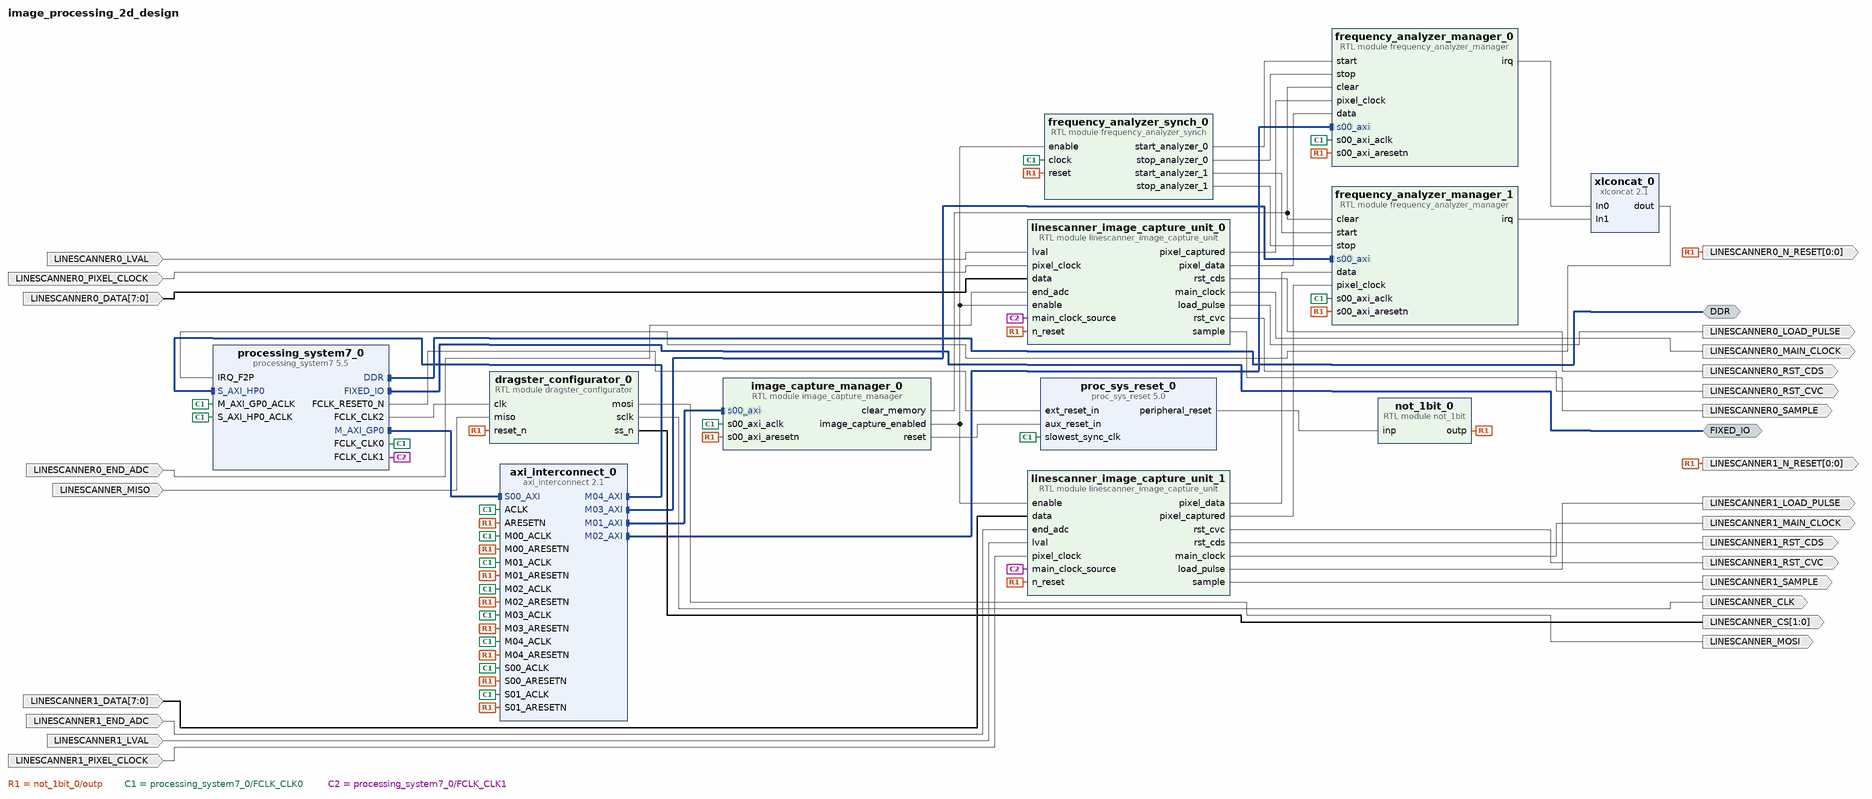
[diagram p0: block diagram of the top level]
# Vivado block design image_processing_2d_design, Vivado 2016.2
create_bd_design image_processing_2d_design

create_bd_intf_port -mode Master -vlnv xilinx.com:interface:ddrx_rtl:1.0 DDR
create_bd_intf_port -mode Master -vlnv xilinx.com:display_processing_system7:fixedio_rtl:1.0 FIXED_IO
create_bd_port -dir O -from 0 -to 0 -type rst LINESCANNER0_N_RESET
create_bd_port -dir O -from 0 -to 0 -type rst LINESCANNER1_N_RESET
create_bd_port -dir I LINESCANNER0_LVAL
create_bd_port -dir I -type clk LINESCANNER0_PIXEL_CLOCK
set_property -dict {CONFIG.FREQ_HZ 25000000} [get_bd_ports LINESCANNER0_PIXEL_CLOCK]
create_bd_port -dir O LINESCANNER0_RST_CVC
create_bd_port -dir O LINESCANNER0_RST_CDS
create_bd_port -dir O LINESCANNER0_SAMPLE
create_bd_port -dir O -type clk LINESCANNER0_MAIN_CLOCK
create_bd_port -dir O LINESCANNER0_LOAD_PULSE
create_bd_port -dir I -from 7 -to 0 LINESCANNER0_DATA
create_bd_port -dir I LINESCANNER0_END_ADC
create_bd_port -dir I -from 7 -to 0 LINESCANNER1_DATA
create_bd_port -dir I LINESCANNER1_END_ADC
create_bd_port -dir I LINESCANNER1_LVAL
create_bd_port -dir I -type clk LINESCANNER1_PIXEL_CLOCK
set_property -dict {CONFIG.FREQ_HZ 25000000} [get_bd_ports LINESCANNER1_PIXEL_CLOCK]
create_bd_port -dir O LINESCANNER1_RST_CVC
create_bd_port -dir O LINESCANNER1_RST_CDS
create_bd_port -dir O LINESCANNER1_SAMPLE
create_bd_port -dir O -type clk LINESCANNER1_MAIN_CLOCK
create_bd_port -dir O LINESCANNER1_LOAD_PULSE
create_bd_port -dir O LINESCANNER_MOSI
create_bd_port -dir I LINESCANNER_MISO
create_bd_port -dir O -type clk LINESCANNER_CLK
create_bd_port -dir O -from 1 -to 0 LINESCANNER_CS

create_bd_cell -type ip -vlnv xilinx.com:ip:processing_system7:5.5 processing_system7_0
set_property -dict [list \
  CONFIG.PCW_FCLK_CLK0_BUF true \
  CONFIG.PCW_FCLK_CLK1_BUF true \
  CONFIG.PCW_FCLK_CLK2_BUF true \
  CONFIG.PCW_UIPARAM_DDR_FREQ_MHZ 533.333313 \
  CONFIG.PCW_CPU_CPU_6X4X_MAX_RANGE 867 \
  CONFIG.PCW_APU_PERIPHERAL_FREQMHZ 666.666667 \
  CONFIG.PCW_SDIO_PERIPHERAL_FREQMHZ 50 \
  CONFIG.PCW_UART_PERIPHERAL_FREQMHZ 50 \
  CONFIG.PCW_FPGA0_PERIPHERAL_FREQMHZ 100 \
  CONFIG.PCW_FPGA1_PERIPHERAL_FREQMHZ 50 \
  CONFIG.PCW_FPGA2_PERIPHERAL_FREQMHZ 20 \
  CONFIG.PCW_USE_S_AXI_HP0 1 \
  CONFIG.PCW_M_AXI_GP0_FREQMHZ 50 \
  CONFIG.PCW_S_AXI_HP0_FREQMHZ 142 \
  CONFIG.PCW_USE_CROSS_TRIGGER 1 \
  CONFIG.PCW_FTM_CTI_IN0 DISABLED \
  CONFIG.PCW_FTM_CTI_IN1 DISABLED \
  CONFIG.PCW_FTM_CTI_IN2 DISABLED \
  CONFIG.PCW_FTM_CTI_IN3 DISABLED \
  CONFIG.PCW_FTM_CTI_OUT0 DISABLED \
  CONFIG.PCW_FTM_CTI_OUT1 DISABLED \
  CONFIG.PCW_FTM_CTI_OUT2 DISABLED \
  CONFIG.PCW_FTM_CTI_OUT3 DISABLED \
  CONFIG.PCW_USE_FABRIC_INTERRUPT 1 \
  CONFIG.PCW_GPIO_EMIO_GPIO_WIDTH 4 \
  CONFIG.PCW_S_AXI_HP0_DATA_WIDTH 32 \
  CONFIG.PCW_EN_CLK1_PORT 1 \
  CONFIG.PCW_EN_CLK2_PORT 1 \
  CONFIG.PCW_EN_RST1_PORT 1 \
  CONFIG.PCW_IRQ_F2P_INTR 1 \
  CONFIG.PCW_PERIPHERAL_BOARD_PRESET part0 \
  CONFIG.PCW_PRESET_BANK1_VOLTAGE {LVCMOS 3.3V} \
  CONFIG.PCW_UIPARAM_DDR_BUS_WIDTH {16 Bit} \
  CONFIG.PCW_UIPARAM_DDR_PARTNO Custom \
  CONFIG.PCW_NAND_PERIPHERAL_ENABLE 1 \
  CONFIG.PCW_NAND_NAND_IO {MIO 0 2.. 14} \
  CONFIG.PCW_ENET0_PERIPHERAL_ENABLE 0 \
  CONFIG.PCW_SD0_PERIPHERAL_ENABLE 1 \
  CONFIG.PCW_SD0_SD0_IO {MIO 28 .. 33} \
  CONFIG.PCW_SD0_GRP_CD_ENABLE 1 \
  CONFIG.PCW_SD0_GRP_CD_IO {MIO 35} \
  CONFIG.PCW_SD0_GRP_WP_ENABLE 1 \
  CONFIG.PCW_SD0_GRP_WP_IO {MIO 34} \
  CONFIG.PCW_UART1_PERIPHERAL_ENABLE 1 \
  CONFIG.PCW_UART1_UART1_IO {MIO 48 .. 49} \
  CONFIG.PCW_TTC0_PERIPHERAL_ENABLE 1 \
  CONFIG.PCW_TTC0_TTC0_IO EMIO \
  CONFIG.PCW_USB0_PERIPHERAL_ENABLE 0 \
  CONFIG.PCW_USB_RESET_ENABLE 0 \
  CONFIG.PCW_I2C_RESET_ENABLE 0 \
  CONFIG.PCW_GPIO_MIO_GPIO_ENABLE 1 \
  CONFIG.PCW_GPIO_MIO_GPIO_IO MIO \
  CONFIG.PCW_GPIO_EMIO_GPIO_ENABLE 1 \
  CONFIG.PCW_GPIO_EMIO_GPIO_IO 4 \
  CONFIG.PCW_ENET1_PERIPHERAL_CLKSRC External \
  CONFIG.PCW_UIPARAM_GENERATE_SUMMARY NONE \
  CONFIG.PCW_FPGA_FCLK1_ENABLE 1 \
  CONFIG.PCW_FPGA_FCLK2_ENABLE 1 \
] [get_bd_cells processing_system7_0]
# 504 more settings of processing_system7_0 are not shown: defaults, MIO pin electricals, DDR timing, and values the tool derives
create_bd_cell -type ip -vlnv xilinx.com:ip:proc_sys_reset:5.0 proc_sys_reset_0
set_property -dict {CONFIG.C_AUX_RST_WIDTH 16 CONFIG.C_EXT_RST_WIDTH 16} [get_bd_cells proc_sys_reset_0]
create_bd_cell -type ip -vlnv xilinx.com:ip:axi_interconnect:2.1 axi_interconnect_0
set_property -dict {CONFIG.NUM_SI 2 CONFIG.NUM_MI 5} [get_bd_cells axi_interconnect_0]
create_bd_cell -type ip -vlnv xilinx.com:ip:xlconcat:2.1 xlconcat_0
set_property -dict {CONFIG.IN0_WIDTH 1 CONFIG.IN1_WIDTH 1} [get_bd_cells xlconcat_0]
create_bd_cell -type module -reference frequency_analyzer_synch frequency_analyzer_synch_0
create_bd_cell -type module -reference linescanner_image_capture_unit linescanner_image_capture_unit_0
create_bd_cell -type module -reference not_1bit not_1bit_0
create_bd_cell -type module -reference image_capture_manager image_capture_manager_0
create_bd_cell -type module -reference linescanner_image_capture_unit linescanner_image_capture_unit_1
create_bd_cell -type module -reference frequency_analyzer_manager frequency_analyzer_manager_0
set_property -dict [list \
  CONFIG.PIXEL0_INDEX 63 \
  CONFIG.PIXEL1_INDEX 511 \
  CONFIG.PIXEL2_INDEX 1000 \
  CONFIG.PIXEL0_FREQUENCY0 5000 \
  CONFIG.PIXEL0_FREQUENCY1 10000 \
  CONFIG.PIXEL2_FREQUENCY0 40000 \
  CONFIG.PIXEL2_FREQUENCY1 50000 \
  CONFIG.FREQUENCY_DEVIATION 20 \
] [get_bd_cells frequency_analyzer_manager_0]
create_bd_cell -type module -reference frequency_analyzer_manager frequency_analyzer_manager_1
set_property -dict [list \
  CONFIG.PIXEL0_INDEX 63 \
  CONFIG.PIXEL2_INDEX 1000 \
  CONFIG.PIXEL0_FREQUENCY0 5000 \
  CONFIG.PIXEL0_FREQUENCY1 10000 \
  CONFIG.PIXEL2_FREQUENCY0 40000 \
  CONFIG.PIXEL2_FREQUENCY1 50000 \
  CONFIG.FREQUENCY_DEVIATION 20 \
] [get_bd_cells frequency_analyzer_manager_1]
create_bd_cell -type module -reference dragster_configurator dragster_configurator_0

# ---- connections ----

connect_bd_intf_net [get_bd_intf_pins processing_system7_0/M_AXI_GP0] [get_bd_intf_pins axi_interconnect_0/S00_AXI]
connect_bd_intf_net [get_bd_intf_pins image_capture_manager_0/s00_axi] [get_bd_intf_pins axi_interconnect_0/M01_AXI]
connect_bd_intf_net [get_bd_intf_pins frequency_analyzer_manager_0/s00_axi] [get_bd_intf_pins axi_interconnect_0/M02_AXI]
connect_bd_intf_net [get_bd_intf_pins axi_interconnect_0/M03_AXI] [get_bd_intf_pins frequency_analyzer_manager_1/s00_axi]
connect_bd_intf_net [get_bd_intf_pins axi_interconnect_0/M04_AXI] [get_bd_intf_pins processing_system7_0/S_AXI_HP0]
connect_bd_intf_net [get_bd_intf_ports DDR] [get_bd_intf_pins processing_system7_0/DDR]
connect_bd_intf_net [get_bd_intf_ports FIXED_IO] [get_bd_intf_pins processing_system7_0/FIXED_IO]
connect_bd_net [get_bd_pins processing_system7_0/FCLK_RESET0_N] [get_bd_pins proc_sys_reset_0/ext_reset_in]
connect_bd_net -net proc_sys_reset_0_peripheral_aresetn [get_bd_pins not_1bit_0/outp] \
  [get_bd_ports LINESCANNER1_N_RESET] [get_bd_ports LINESCANNER0_N_RESET] [get_bd_pins frequency_analyzer_synch_0/reset] \
  [get_bd_pins linescanner_image_capture_unit_0/n_reset] [get_bd_pins image_capture_manager_0/s00_axi_aresetn] \
  [get_bd_pins axi_interconnect_0/ARESETN] [get_bd_pins axi_interconnect_0/S00_ARESETN] \
  [get_bd_pins axi_interconnect_0/M00_ARESETN] [get_bd_pins axi_interconnect_0/M01_ARESETN] \
  [get_bd_pins axi_interconnect_0/S01_ARESETN] [get_bd_pins axi_interconnect_0/M02_ARESETN] \
  [get_bd_pins axi_interconnect_0/M03_ARESETN] [get_bd_pins axi_interconnect_0/M04_ARESETN] \
  [get_bd_pins linescanner_image_capture_unit_1/n_reset] [get_bd_pins frequency_analyzer_manager_0/s00_axi_aresetn] \
  [get_bd_pins frequency_analyzer_manager_1/s00_axi_aresetn] [get_bd_pins dragster_configurator_0/reset_n]
connect_bd_net [get_bd_pins image_capture_manager_0/image_capture_enabled] \
  [get_bd_pins frequency_analyzer_synch_0/enable] [get_bd_pins linescanner_image_capture_unit_0/enable] \
  [get_bd_pins linescanner_image_capture_unit_1/enable]
connect_bd_net [get_bd_pins processing_system7_0/FCLK_CLK0] \
  [get_bd_pins proc_sys_reset_0/slowest_sync_clk] [get_bd_pins processing_system7_0/M_AXI_GP0_ACLK] \
  [get_bd_pins processing_system7_0/S_AXI_HP0_ACLK] [get_bd_pins frequency_analyzer_synch_0/clock] \
  [get_bd_pins image_capture_manager_0/s00_axi_aclk] [get_bd_pins axi_interconnect_0/ACLK] \
  [get_bd_pins axi_interconnect_0/S00_ACLK] [get_bd_pins axi_interconnect_0/M00_ACLK] \
  [get_bd_pins axi_interconnect_0/M01_ACLK] [get_bd_pins axi_interconnect_0/S01_ACLK] \
  [get_bd_pins axi_interconnect_0/M02_ACLK] [get_bd_pins axi_interconnect_0/M03_ACLK] \
  [get_bd_pins axi_interconnect_0/M04_ACLK] [get_bd_pins frequency_analyzer_manager_0/s00_axi_aclk] \
  [get_bd_pins frequency_analyzer_manager_1/s00_axi_aclk]
connect_bd_net [get_bd_pins xlconcat_0/dout] [get_bd_pins processing_system7_0/IRQ_F2P]
connect_bd_net -net frequency_analyzer_manager_1_irq [get_bd_pins frequency_analyzer_manager_0/irq] [get_bd_pins xlconcat_0/In0]
connect_bd_net -net frequency_analyzer_manager_0_irq [get_bd_pins frequency_analyzer_manager_1/irq] [get_bd_pins xlconcat_0/In1]
connect_bd_net [get_bd_ports LINESCANNER0_LVAL] [get_bd_pins linescanner_image_capture_unit_0/lval]
connect_bd_net [get_bd_ports LINESCANNER0_PIXEL_CLOCK] [get_bd_pins linescanner_image_capture_unit_0/pixel_clock]
connect_bd_net [get_bd_pins linescanner_image_capture_unit_0/rst_cvc] [get_bd_ports LINESCANNER0_RST_CVC]
connect_bd_net [get_bd_pins linescanner_image_capture_unit_0/rst_cds] [get_bd_ports LINESCANNER0_RST_CDS]
connect_bd_net [get_bd_pins linescanner_image_capture_unit_0/sample] [get_bd_ports LINESCANNER0_SAMPLE]
connect_bd_net [get_bd_pins linescanner_image_capture_unit_0/main_clock] [get_bd_ports LINESCANNER0_MAIN_CLOCK]
connect_bd_net [get_bd_pins linescanner_image_capture_unit_0/load_pulse] [get_bd_ports LINESCANNER0_LOAD_PULSE]
connect_bd_net [get_bd_ports LINESCANNER0_DATA] [get_bd_pins linescanner_image_capture_unit_0/data]
connect_bd_net [get_bd_ports LINESCANNER0_END_ADC] [get_bd_pins linescanner_image_capture_unit_0/end_adc]
connect_bd_net [get_bd_ports LINESCANNER1_DATA] [get_bd_pins linescanner_image_capture_unit_1/data]
connect_bd_net [get_bd_ports LINESCANNER1_END_ADC] [get_bd_pins linescanner_image_capture_unit_1/end_adc]
connect_bd_net [get_bd_ports LINESCANNER1_LVAL] [get_bd_pins linescanner_image_capture_unit_1/lval]
connect_bd_net [get_bd_ports LINESCANNER1_PIXEL_CLOCK] [get_bd_pins linescanner_image_capture_unit_1/pixel_clock]
connect_bd_net [get_bd_pins linescanner_image_capture_unit_1/rst_cvc] [get_bd_ports LINESCANNER1_RST_CVC]
connect_bd_net [get_bd_pins linescanner_image_capture_unit_1/rst_cds] [get_bd_ports LINESCANNER1_RST_CDS]
connect_bd_net [get_bd_pins linescanner_image_capture_unit_1/sample] [get_bd_ports LINESCANNER1_SAMPLE]
connect_bd_net [get_bd_pins linescanner_image_capture_unit_1/main_clock] [get_bd_ports LINESCANNER1_MAIN_CLOCK]
connect_bd_net [get_bd_pins linescanner_image_capture_unit_1/load_pulse] [get_bd_ports LINESCANNER1_LOAD_PULSE]
connect_bd_net [get_bd_pins frequency_analyzer_synch_0/start_analyzer_0] [get_bd_pins frequency_analyzer_manager_0/start]
connect_bd_net [get_bd_pins frequency_analyzer_synch_0/stop_analyzer_0] [get_bd_pins frequency_analyzer_manager_0/stop]
connect_bd_net [get_bd_pins linescanner_image_capture_unit_0/pixel_captured] [get_bd_pins frequency_analyzer_manager_0/pixel_clock]
connect_bd_net [get_bd_pins linescanner_image_capture_unit_0/pixel_data] [get_bd_pins frequency_analyzer_manager_0/data]
connect_bd_net [get_bd_pins frequency_analyzer_synch_0/start_analyzer_1] [get_bd_pins frequency_analyzer_manager_1/start]
connect_bd_net [get_bd_pins frequency_analyzer_synch_0/stop_analyzer_1] [get_bd_pins frequency_analyzer_manager_1/stop]
connect_bd_net [get_bd_pins linescanner_image_capture_unit_1/pixel_data] [get_bd_pins frequency_analyzer_manager_1/data]
connect_bd_net [get_bd_pins linescanner_image_capture_unit_1/pixel_captured] [get_bd_pins frequency_analyzer_manager_1/pixel_clock]
connect_bd_net [get_bd_pins image_capture_manager_0/clear_memory] \
  [get_bd_pins frequency_analyzer_manager_0/clear] [get_bd_pins frequency_analyzer_manager_1/clear]
connect_bd_net [get_bd_pins proc_sys_reset_0/peripheral_reset] [get_bd_pins not_1bit_0/inp]
connect_bd_net [get_bd_pins dragster_configurator_0/mosi] [get_bd_ports LINESCANNER_MOSI]
connect_bd_net [get_bd_ports LINESCANNER_MISO] [get_bd_pins dragster_configurator_0/miso]
connect_bd_net [get_bd_pins dragster_configurator_0/sclk] [get_bd_ports LINESCANNER_CLK]
connect_bd_net [get_bd_pins dragster_configurator_0/ss_n] [get_bd_ports LINESCANNER_CS]
connect_bd_net [get_bd_pins processing_system7_0/FCLK_CLK2] [get_bd_pins dragster_configurator_0/clk]
connect_bd_net [get_bd_pins image_capture_manager_0/reset] [get_bd_pins proc_sys_reset_0/aux_reset_in]
connect_bd_net [get_bd_pins processing_system7_0/FCLK_CLK1] \
  [get_bd_pins linescanner_image_capture_unit_0/main_clock_source] \
  [get_bd_pins linescanner_image_capture_unit_1/main_clock_source]

# ---- address map ----
assign_bd_address -offset 0x43C00000 -range 4K -target_address_space [get_bd_addr_spaces processing_system7_0/Data] [get_bd_addr_segs image_capture_manager_0/s00_axi/reg0]
assign_bd_address -offset 0x43C10000 -range 4K -target_address_space [get_bd_addr_spaces processing_system7_0/Data] [get_bd_addr_segs frequency_analyzer_manager_0/s00_axi/reg0]
assign_bd_address -offset 0x43C20000 -range 4K -target_address_space [get_bd_addr_spaces processing_system7_0/Data] [get_bd_addr_segs frequency_analyzer_manager_1/s00_axi/reg0]
assign_bd_address -offset 0x50000000 -range 256M -target_address_space [get_bd_addr_spaces processing_system7_0/Data] [get_bd_addr_segs processing_system7_0/S_AXI_HP0/HP0_DDR_LOWOCM]

validate_bd_design
save_bd_design
